# EAGLE board Titan_Teknic_v1p00a (EAGLE 9.6.2), part 1 of 2
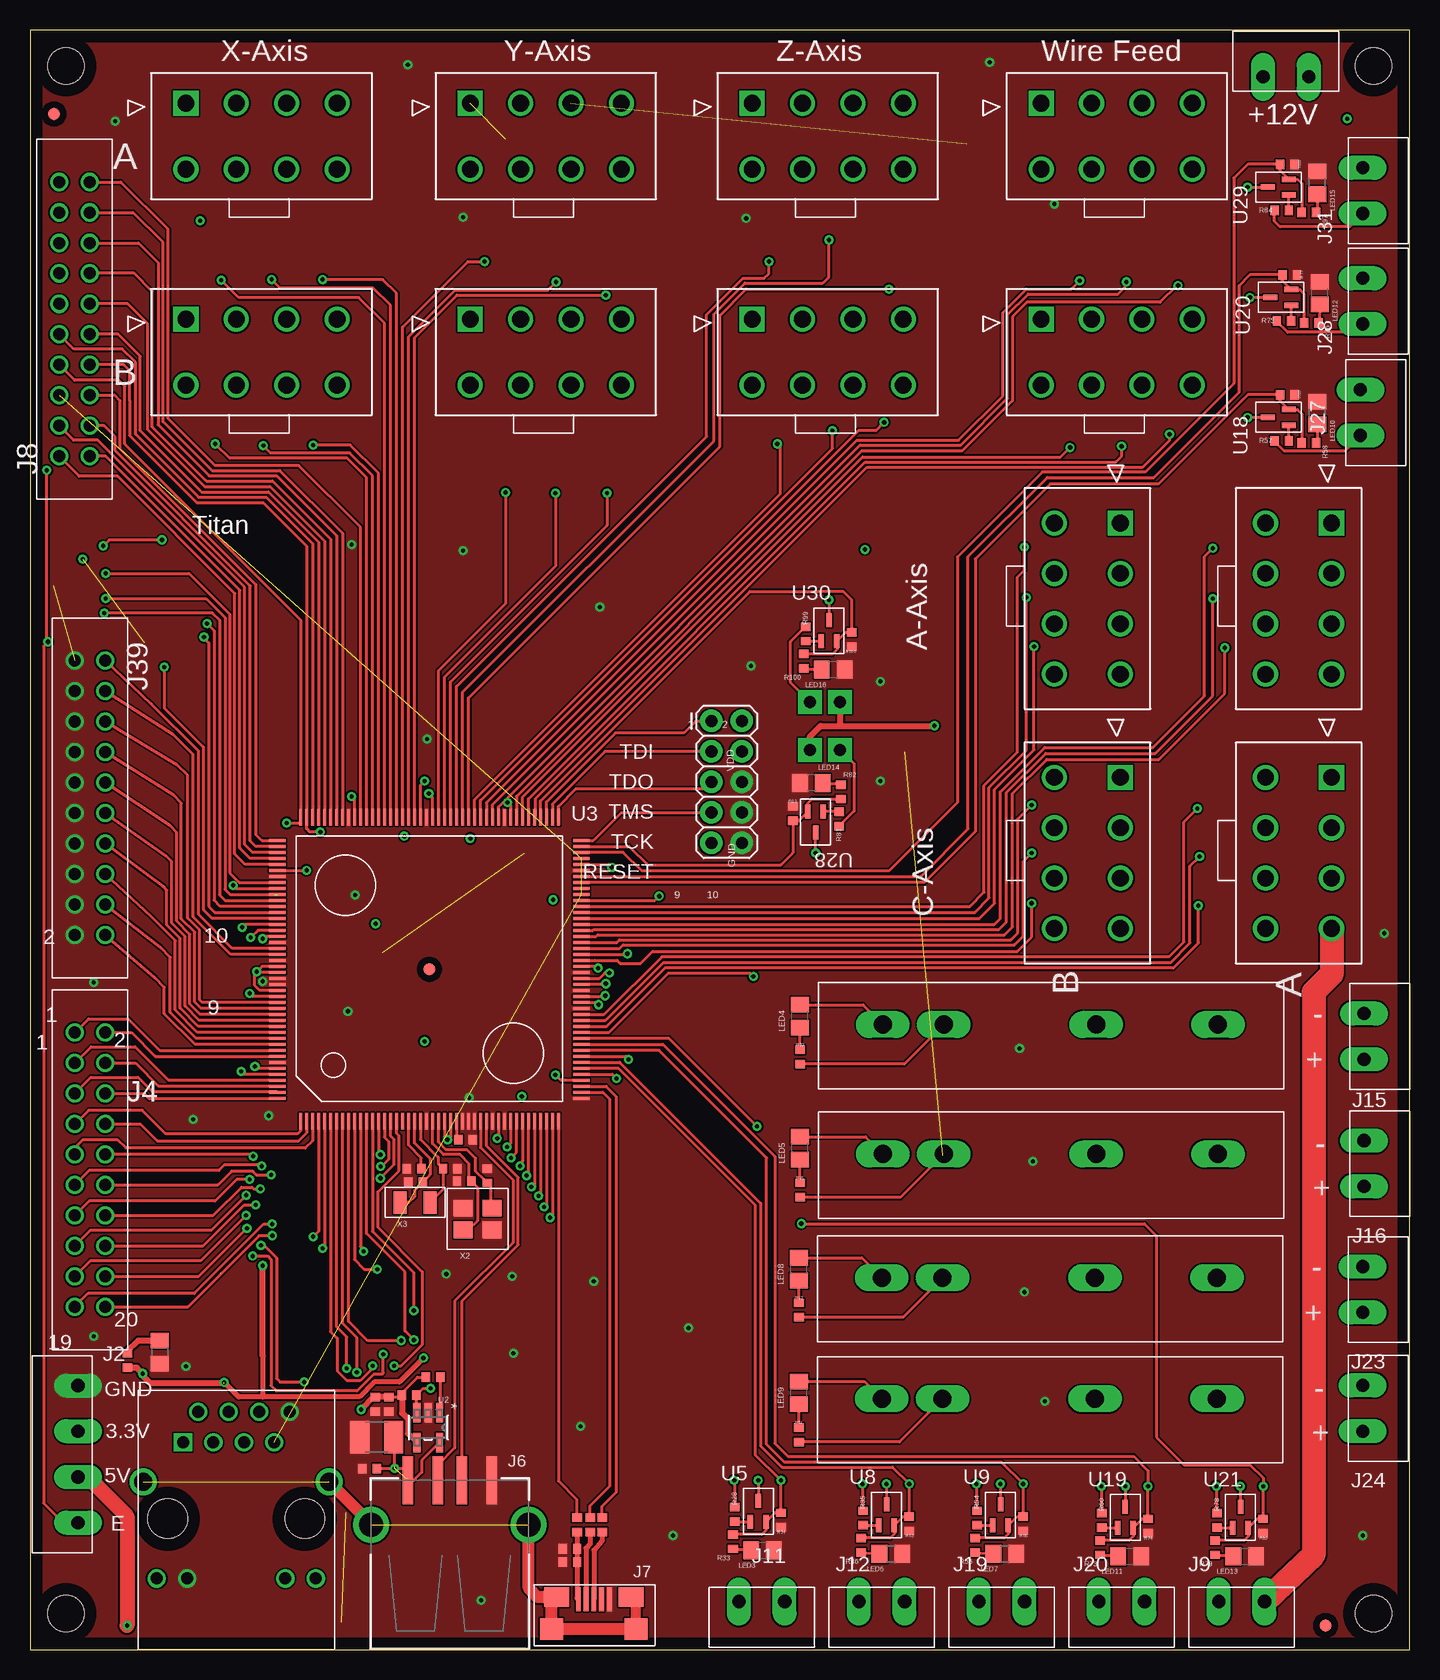
[diagram p7: board, top side]
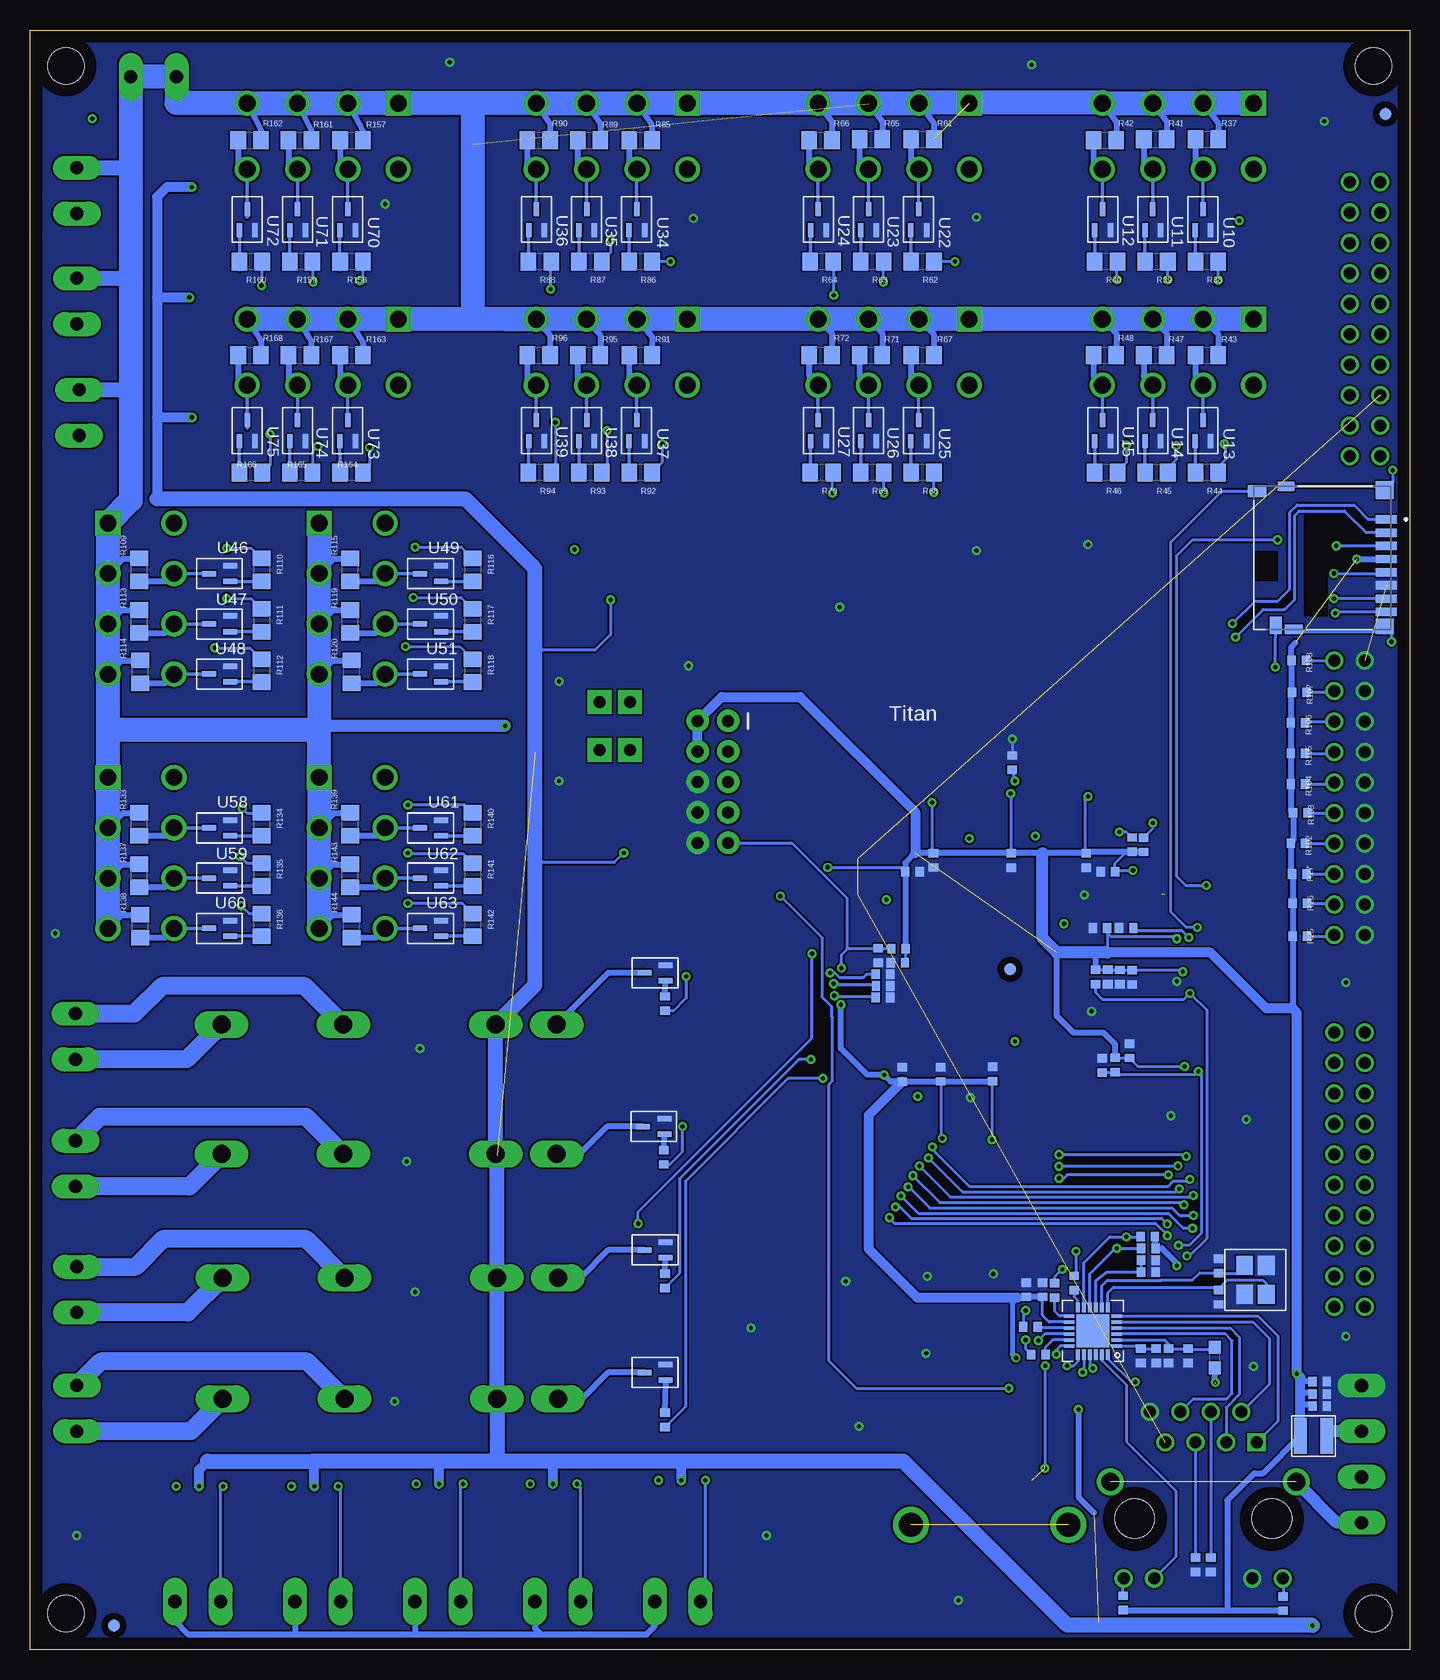
[diagram p8: board, bottom side, seen from below]

Size 115 x 135 mm. Coordinates in mm from the lower left corner, seen from the top.
Outline: 0,0 115,0 115,135 0,135 0,0
Copper layers (1*16): Top 0.035mm / dielectric 1.5mm / Bottom 0.035mm
Design rules "default": minimum track width 6mil, minimum drill 0.35mm, track to track 6mil, track to pad 6mil, pad to pad 6mil, via to via 6mil, smd to smd 6mil, copper to edge 40mil, drill to drill 6mil, minimum pad ring 10mil, minimum via ring 8mil, stop-mask expansion 4mil, vias tented up to drill 0mil, thermal gap 10mil
Holes 3 mm at 3,132 112,132 112,3 3,3

## Footprints (pad centres in the part's own frame; a part is rotated, then mirrored left to right if it is on the bottom)
FIDUCIAL_1MM = smd 1 x 1: 1 0,0
0402 = smd 0.8 x 0.7: P$1 0,0.6; P$2 0,-0.6
C1210 = smd 1.6 x 2.7: 1 -1.4,0; 2 1.4,0
0603 = smd 1.1 x 1: 1 -0.85,0; 2 0.85,0
SD_CARD = smd 0.7 x 1.75: 1 3.2,-5.285; 2 2.1,-5.285; 3 1,-5.285; 4 -0.1,-5.285; 5 -1.2,-5.285; 6 -2.3,-5.285; 7 -3.4,-5.285; 8 -4.5,-5.285 | smd 1 x 1.55: 9 5.575,5.515 | smd 1.45 x 1: 10 -5.625,3.94 | smd 1.5 x 1.5: S1 5.65,-5.16 | smd 1.3 x 1.5: S2 -5.7,-5.16 | smd 0.8 x 1.4: S3 5.975,3.09 | smd 0.8 x 1.5: S4 -5.95,2.44
1X4_3.81MM_PITCH = drill 1.1 pad 2 long: P$1 0,0; P$2 3.81,0; P$3 7.62,0; P$4 11.43,0
2X5 = drill 1 pad 1.88: 1 0,0; 2 0,2.54; 3 2.54,0; 4 2.54,2.54; 5 5.08,0; 6 5.08,2.54; 7 7.62,0; 8 7.62,2.54; 9 10.16,0; 10 10.16,2.54
2_X_10_.1_INCH = drill 1: P$1 -11.43,-1.27; P$2 -11.43,1.27; P$3 -8.89,-1.27; P$4 -8.89,1.27; P$5 -6.35,-1.27; P$6 -6.35,1.27; P$7 -3.81,-1.27; P$8 -3.81,1.27; P$9 -1.27,-1.27; P$10 -1.27,1.27; P$11 1.27,-1.27; P$12 1.27,1.27; P$13 3.81,-1.27; P$14 3.81,1.27; P$15 6.35,-1.27; P$16 6.35,1.27; P$17 8.89,-1.27; P$18 8.89,1.27; P$19 11.43,-1.27; P$20 11.43,1.27
USB_A_SMT = smd 4 x 0.9: D+ 6.7,-1; D- 6.7,1; GND 6.7,-3.5; VBUS 6.7,3.5 | drill 2: SHLD1 3,-6.566; SHLD2 3,6.566
USB_MICRO-B = smd 0.4 x 2: P$1 -1.3,2.475; P$2 -0.65,2.475; P$3 0,2.475; P$4 0.65,2.475; P$5 1.3,2.475 | smd 2.1 x 1.6: P$6 -3.1,2.675; P$7 3.1,2.675 | smd 1.9 x 1.8: P$8 -3.525,0; P$9 3.525,0
2_3.81MM_PITCH = drill 1.1 pad 2 long: P$1 0,0; P$2 3.81,0
CON_39281083 = drill 1.397 pad 1.905 square: 1 12.6,-5.5 | drill 1.397 pad 1.905: 2 8.4,-5.5; 3 4.2,-5.5; 4 0,-5.5; 5 12.6,0; 6 8.4,0; 7 4.2,0; 8 0,0
1008 = smd 3 x 1.1: 1 0,1.1; 2 0,-1.1
0805 = smd 1.3 x 1.5: 1 -0.95,0; 2 0.95,0
1_X_1_1MM_PIN = drill 1 pad 2 square: P$1 0,0
RJ45_TH_ELEC = drill 1 square: 1 -4.45,-2.54 | drill 1: 2 -3.18,0; 3 -1.91,-2.54; 4 -0.635,0; 5 0.635,-2.54; 6 1.91,0; 7 3.17,-2.54; 8 4.445,0; 9 -6.63,-13.88; 10 -4.09,-13.88; 11 4.09,-13.88; 12 6.63,-13.88 | drill 1.5: 13 -7.75,-5.84; 14 7.75,-5.84 | hole 3.299: 5.715,-8.89; -5.715,-8.89
QFN-24-M = smd 0.864 x 0.305: 1 -1.968,1.25; 2 -1.968,0.75; 3 -1.968,0.25; 4 -1.968,-0.25; 5 -1.968,-0.75; 6 -1.968,-1.25; 13 1.968,-1.25; 14 1.968,-0.75; 15 1.968,-0.25; 16 1.968,0.25; 17 1.968,0.75; 18 1.968,1.25 | smd 0.305 x 0.864: 7 -1.25,-1.968; 8 -0.75,-1.968; 9 -0.25,-1.968; 10 0.25,-1.968; 11 0.75,-1.968; 12 1.25,-1.968; 19 1.25,1.968; 20 0.75,1.968; 21 0.25,1.968; 22 -0.25,1.968; 23 -0.75,1.968; 24 -1.25,1.968 | smd 2.743 x 2.743: 25 0,0
SOT-23-5 = smd 1.626 x 0.61: 1 -1.245,0.95; 2 -1.245,0; 3 -1.245,-0.95; 4 1.245,-0.95; 5 1.245,0.95
LQFP176_24X24 = smd 1.372 x 0.254: 1 -12.675,10.75; 2 -12.675,10.25; 3 -12.675,9.75; 4 -12.675,9.25; 5 -12.675,8.75; 6 -12.675,8.25; 7 -12.675,7.75; 8 -12.675,7.25; 9 -12.675,6.75; 10 -12.675,6.25; 11 -12.675,5.75; 12 -12.675,5.25; 13 -12.675,4.75; 14 -12.675,4.25; 15 -12.675,3.75; 16 -12.675,3.25; 17 -12.675,2.75; 18 -12.675,2.25; 19 -12.675,1.75; 20 -12.675,1.25; 21 -12.675,0.75; 22 -12.675,0.25; 23 -12.675,-0.25; 24 -12.675,-0.75; 25 -12.675,-1.25; 26 -12.675,-1.75; 27 -12.675,-2.25; 28 -12.675,-2.75; 29 -12.675,-3.25; 30 -12.675,-3.75; 31 -12.675,-4.25; 32 -12.675,-4.75; 33 -12.675,-5.25; 34 -12.675,-5.75; 35 -12.675,-6.25; 36 -12.675,-6.75; 37 -12.675,-7.25; 38 -12.675,-7.75; 39 -12.675,-8.25; 40 -12.675,-8.75; 41 -12.675,-9.25; 42 -12.675,-9.75; 43 -12.675,-10.25; 44 -12.675,-10.75; 89 12.675,-10.75; 90 12.675,-10.25; 91 12.675,-9.75; 92 12.675,-9.25; 93 12.675,-8.75; 94 12.675,-8.25; 95 12.675,-7.75; 96 12.675,-7.25; 97 12.675,-6.75; 98 12.675,-6.25; 99 12.675,-5.75; 100 12.675,-5.25; 101 12.675,-4.75; 102 12.675,-4.25; 103 12.675,-3.75; 104 12.675,-3.25; 105 12.675,-2.75; 106 12.675,-2.25; 107 12.675,-1.75; 108 12.675,-1.25; 109 12.675,-0.75; 110 12.675,-0.25; 111 12.675,0.25; 112 12.675,0.75; 113 12.675,1.25; 114 12.675,1.75; 115 12.675,2.25; 116 12.675,2.75; 117 12.675,3.25; 118 12.675,3.75; 119 12.675,4.25; 120 12.675,4.75; 121 12.675,5.25; 122 12.675,5.75; 123 12.675,6.25; 124 12.675,6.75; 125 12.675,7.25; 126 12.675,7.75; 127 12.675,8.25; 128 12.675,8.75; 129 12.675,9.25; 130 12.675,9.75; 131 12.675,10.25; 132 12.675,10.75 | smd 0.254 x 1.372: 45 -10.75,-12.675; 46 -10.25,-12.675; 47 -9.75,-12.675; 48 -9.25,-12.675; 49 -8.75,-12.675; 50 -8.25,-12.675; 51 -7.75,-12.675; 52 -7.25,-12.675; 53 -6.75,-12.675; 54 -6.25,-12.675; 55 -5.75,-12.675; 56 -5.25,-12.675; 57 -4.75,-12.675; 58 -4.25,-12.675; 59 -3.75,-12.675; 60 -3.25,-12.675; 61 -2.75,-12.675; 62 -2.25,-12.675; 63 -1.75,-12.675; 64 -1.25,-12.675; 65 -0.75,-12.675; 66 -0.25,-12.675; 67 0.25,-12.675; 68 0.75,-12.675; 69 1.25,-12.675; 70 1.75,-12.675; 71 2.25,-12.675; 72 2.75,-12.675; 73 3.25,-12.675; 74 3.75,-12.675; 75 4.25,-12.675; 76 4.75,-12.675; 77 5.25,-12.675; 78 5.75,-12.675; 79 6.25,-12.675; 80 6.75,-12.675; 81 7.25,-12.675; 82 7.75,-12.675; 83 8.25,-12.675; 84 8.75,-12.675; 85 9.25,-12.675; 86 9.75,-12.675; 87 10.25,-12.675; 88 10.75,-12.675; 133 10.75,12.675; 134 10.25,12.675; 135 9.75,12.675; 136 9.25,12.675; 137 8.75,12.675; 138 8.25,12.675; 139 7.75,12.675; 140 7.25,12.675; 141 6.75,12.675; 142 6.25,12.675; 143 5.75,12.675; 144 5.25,12.675; 145 4.75,12.675; 146 4.25,12.675; 147 3.75,12.675; 148 3.25,12.675; 149 2.75,12.675; 150 2.25,12.675; 151 1.75,12.675; 152 1.25,12.675; 153 0.75,12.675; 154 0.25,12.675; 155 -0.25,12.675; 156 -0.75,12.675; 157 -1.25,12.675; 158 -1.75,12.675; 159 -2.25,12.675; 160 -2.75,12.675; 161 -3.25,12.675; 162 -3.75,12.675; 163 -4.25,12.675; 164 -4.75,12.675; 165 -5.25,12.675; 166 -5.75,12.675; 167 -6.25,12.675; 168 -6.75,12.675; 169 -7.25,12.675; 170 -7.75,12.675; 171 -8.25,12.675; 172 -8.75,12.675; 173 -9.25,12.675; 174 -9.75,12.675; 175 -10.25,12.675; 176 -10.75,12.675
SOT323 = smd 0.457 x 1.168: 1 -0.65,-0.876; 2 0.65,-0.876; 3 0,0.876
RELAY_KYOTO_KF0604D = drill 1.5 long: P$1 0,0; P$2 -5.08,0; P$3 -17.78,0; P$4 -27.94,0
SMD_3225 = smd 1.6 x 1.4: 1 -1.2,-0.9; 2 1.2,-0.9; 3 1.2,0.9; 4 -1.2,0.9
SMD_X_2_PADS = smd 1.9 x 1.1: P$1 0,1.25; P$2 0,-1.25

## Placement (x,y rotation side)
AFID1  FIDUCIAL_1MM  [FIDUCIAL_1MM]  108,2 0 top
AFID2  FIDUCIAL_1MM  [FIDUCIAL_1MM]  2,128 0 top
AFID3  FIDUCIAL_1MM  [FIDUCIAL_1MM]  33.3,56.7 0 top
AFID4  FIDUCIAL_1MM  [FIDUCIAL_1MM]  108,2 0 bottom
AFID5  FIDUCIAL_1MM  [FIDUCIAL_1MM]  2,128 0 bottom
AFID6  FIDUCIAL_1MM  [FIDUCIAL_1MM]  33.3,56.7 0 bottom
C1  24pF  [0402]  15.91,31.98 180 bottom
C2  24pF  [0402]  15.91,29.37 0 bottom
C3  100pF  [0402]  21.76,31.46 90 bottom
C4  0.1uF  [0402]  7.5,22.35 90 bottom
C5  10uF  [0402]  7.5,21.3 90 bottom
C6  10uF  [0402]  25.61,48.7 180 bottom
C7  0.1uF  [0402]  7.5,20.3 90 bottom
C8  22uF  [0402]  18.46,24.48 0 bottom
C9  0.1uF  [0402]  20.09,24.48 0 bottom
C10  0.1uF  [0402]  22.4,24.48 0 bottom
C11  2.2uF  [0402]  21.12,24.48 0 bottom
C12  0.1uF  [0402]  16.56,7.07 0 bottom
C13  0.1uF  [0402]  17.84,7.07 0 bottom
C14  22uF  [0402]  31.95,30 180 bottom
C15  0.1uF  [0402]  30.6,30 180 bottom
C16  10uF  [0402]  44.28,57.85 0 bottom
C17  18pF  [0402]  36.2,39.03 270 top
C18  18pF  [0402]  38.13,39.5 180 top
C19  0.1uF  [0402]  25.8,60.15 90 bottom
C20  0.1uF  [0402]  25.16,64.82 90 bottom
C21  1uF  [0402]  25.15,56.06 180 bottom
C22  0.1uF  [0402]  24.15,56.05 180 bottom
C23  10uF  [0402]  29.9,20.45 0 top
C24  0.1uF  [0402]  23.62,60.14 90 bottom
C25  0.1uF  [0402]  23.13,56.04 180 bottom
C26  0.1uF  [0402]  28.8,20.45 0 top
C27  0.1uF  [0402]  23.35,49.91 0 bottom
C28  1uF  [0402]  45,8.4 270 top
C29  0.1uF  [0402]  28.3,15.1 270 top
C30  0.1uF  [0402]  26.97,65.78 180 bottom
C31  100uF_Tant  [C1210]  28.9,17.7 180 top
C32  12pF  [0402]  32.14,38.97 270 top
C33  0.1uF  [0402]  32.02,40.07 270 top
C34  0.1uF  [0402]  33.11,73.92 0 bottom
C35  0.1uF  [0402]  33.2,65.78 180 bottom
C36  0.1uF  [0402]  34.76,47.99 180 bottom
C37  12pF  [0402]  35.03,40.07 90 top
C38  0.1uF  [0402]  39.69,65.79 180 bottom
C39  0.1uF  [0402]  39.09,47.95 180 bottom
C40  0.1uF  [0402]  42.66,57.24 270 bottom
C41  1uF  [0402]  41.44,64.84 90 bottom
C42  0.1uF  [0402]  43.9,54.35 90 bottom
C43  0.1uF  [0402]  42.29,47.94 0 bottom
FB1  FB2_603  [0603]  16.22,24.33 90 bottom
J1  SD_CARD  [SD_CARD]  7.21,91 90 bottom
J2  4-pos  [1X4_3.81MM_PITCH]  4,22 270 top
J3  10-pos  [2X5]  56.8,77.4 270 top
J4  20-pos  [2_X_10_.1_INCH]  5,40 270 top
J6  USB-A  [USB_A_SMT]  35,7.4 90 top
J7  USB-B-Micro  [USB_MICRO-B]  47,1.7 0 top
J8  [2_X_10_.1_INCH]  3.7,110.9 90 top
J9  2-pos  [2_3.81MM_PITCH]  99.1,4 0 top
J10  2-pos  [2_3.81MM_PITCH]  106.6,131.1 180 top
J11  2-pos  [2_3.81MM_PITCH]  59.1,4 0 top
J12  2-pos  [2_3.81MM_PITCH]  69.1,4 0 top
J13  [CON_39281083]  25.6,123.4 180 top
J14  [CON_39281083]  25.6,105.4 180 top
J15  2-pos  [2_3.81MM_PITCH]  111.2,49.2 90 top
J16  2-pos  [2_3.81MM_PITCH]  111.2,38.6 90 top
J17  [CON_39281083]  49.3,123.4 180 top
J18  [CON_39281083]  49.3,105.4 180 top
J19  2-pos  [2_3.81MM_PITCH]  79.1,4 0 top
J20  2-pos  [2_3.81MM_PITCH]  89.1,4 0 top
J21  [CON_39281083]  72.8,123.4 180 top
J22  [CON_39281083]  72.8,105.4 180 top
J23  2-pos  [2_3.81MM_PITCH]  111.1,28.1 90 top
J24  2-pos  [2_3.81MM_PITCH]  111.1,18.2 90 top
J25  [CON_39281083]  103,81.3 90 top
J26  [CON_39281083]  85.4,81.3 90 top
J27  2-pos  [2_3.81MM_PITCH]  110.9,101.2 90 top
J28  2-pos  [2_3.81MM_PITCH]  111.1,110.5 90 top
J29  [CON_39281083]  103,60.1 90 top
J30  [CON_39281083]  85.4,60.1 90 top
J31  2-pos  [2_3.81MM_PITCH]  111.1,119.7 90 top
J33  [CON_39281083]  96.9,123.4 180 top
J34  [CON_39281083]  96.9,105.4 180 top
J39  [2_X_10_.1_INCH]  5,71 270 top
L1  2.2uH  [1008]  8,17.8 270 bottom
LED1  Green  [0805]  10.8,24.8 270 top
LED3  Green  [0805]  61.06,8.28 0 top
LED4  Green  [0805]  64.2,52.8 90 top
LED5  Green  [0805]  64.2,41.8 90 top
LED6  Green  [0805]  71.76,7.98 0 top
LED7  Green  [0805]  81.26,7.98 0 top
LED8  Green  [0805]  64.1,31.7 90 top
LED9  Green  [0805]  64.1,21.4 90 top
LED10  Green  [0805]  107.32,103.06 90 top
LED11  Green  [0805]  91.66,7.78 0 top
LED12  Green  [0805]  107.52,113.06 90 top
LED13  Green  [0805]  101.26,7.78 0 top
LED14  Green  [0805]  65.14,72.22 180 top
LED15  Green  [0805]  107.32,122.26 90 top
LED16  Green  [0805]  66.96,81.68 0 top
P1  [1_X_1_1MM_PIN]  67.54,75 0 top
P2  [1_X_1_1MM_PIN]  65,75 0 top
P3  [1_X_1_1MM_PIN]  65,79 0 top
P4  [1_X_1_1MM_PIN]  67.54,79 0 top
R1  6K49  [0402]  21.78,32.46 270 bottom
R2  10K0  [0402]  26.16,56.07 180 bottom
R3  10K0  [0402]  24.54,48.72 180 bottom
R4  1K5  [0402]  21.83,34.41 90 bottom
R5  470R0  [0402]  8.12,24.09 0 top
R6  1K5  [0402]  21.78,33.44 90 bottom
R7  470R0  [0402]  23.89,3.88 0 bottom
R8  470R0  [0402]  10.54,3.83 0 bottom
R9  33R0  [0402]  27.95,30.55 0 bottom
R10  33R0  [0402]  29.6,29.95 0 bottom
R11  33R0  [0402]  30.95,24.6 90 bottom
R12  33R0  [0402]  31.6,26.9 90 bottom
R13  10K0  [0402]  42.58,58.42 90 bottom
R14  1K0  [0402]  22.15,67.08 180 bottom
R15  1K0  [0402]  23.13,67.08 180 bottom
R16  15K0  [0402]  45.6,10.4 0 top
R17  27R0  [0402]  46.7,10.4 0 top
R18  27R0  [0402]  47.7,10.4 0 top
R19  10K0  [0402]  31.6,21.2 270 top
R20  10K0  [0402]  33.6,22.7 270 top
R21  30K0  [0402]  45,7.3 90 top
R22  2K2  [0402]  36.31,42.5 270 top
R23  10K0  [0402]  43.88,55.32 270 bottom
R24  10K0  [0402]  43.89,56.28 270 bottom
R25  100K  [0402]  9.15,59.45 270 bottom
R26  100K  [0402]  9.15,62.2 270 bottom
R27  100K  [0402]  9.2,64.65 270 bottom
R28  2.2K  [0402]  58.75,11.26 0 top
R29  500R0  [0402]  62.06,53.84 180 bottom
R30  500R0  [0402]  62.16,41.04 180 bottom
R31  470R0  [0402]  64.2,38.3 0 top
R32  470R0  [0402]  64.2,49.4 0 top
R33  470R0  [0402]  58.6,9 180 top
R34  10K0  [0402]  62.6,10.8 180 top
R35  2.2K  [0402]  69.45,10.96 0 top
R36  470R0  [0402]  69.3,8.7 180 top
R37  1k  [0805]  16.9,125.9 0 bottom
R38  33  [0805]  16.9,115.7 180 bottom
R39  33  [0805]  21.1,115.7 180 bottom
R40  33  [0805]  25.3,115.7 180 bottom
R41  1k  [0805]  21.2,125.9 0 bottom
R42  1k  [0805]  25.4,125.8 0 bottom
R43  1k  [0805]  16.9,107.9 0 bottom
R44  33  [0805]  16.9,98.1 180 bottom
R45  33  [0805]  21.1,98.1 180 bottom
R46  33  [0805]  25.3,98.1 180 bottom
R47  1k  [0805]  21.2,107.9 0 bottom
R48  1k  [0805]  25.4,107.9 0 bottom
R49  500R0  [0402]  62.06,30.74 180 bottom
R50  500R0  [0402]  62.06,19.14 180 bottom
R51  470R0  [0402]  64.1,17.9 0 top
R52  470R0  [0402]  64.1,28.3 0 top
R53  10K0  [0402]  73.3,10.5 180 top
R54  2.2K  [0402]  78.95,10.96 0 top
R55  470R0  [0402]  78.8,8.7 180 top
R56  10K0  [0402]  82.8,10.5 180 top
R57  2.2K  [0402]  104.34,100.75 90 top
R58  470R0  [0402]  106.6,100.6 270 top
R59  10K0  [0402]  104.8,104.6 270 top
R60  2.2K  [0402]  89.35,10.76 0 top
R61  1k  [0805]  40.6,125.9 0 bottom
R62  33  [0805]  40.6,115.7 180 bottom
R63  33  [0805]  44.8,115.7 180 bottom
R64  33  [0805]  49,115.7 180 bottom
R65  1k  [0805]  44.9,125.9 0 bottom
R66  1k  [0805]  49.1,125.8 0 bottom
R67  1k  [0805]  40.6,107.9 0 bottom
R68  33  [0805]  40.6,98.1 180 bottom
R69  33  [0805]  44.8,98.1 180 bottom
R70  33  [0805]  49,98.1 180 bottom
R71  1k  [0805]  44.9,107.9 0 bottom
R72  1k  [0805]  49.1,107.9 0 bottom
R73  470R0  [0402]  89.2,8.5 180 top
R74  10K0  [0402]  93.2,10.3 180 top
R75  2.2K  [0402]  104.54,110.75 90 top
R76  470R0  [0402]  106.8,110.6 270 top
R77  10K0  [0402]  105,114.6 270 top
R78  2.2K  [0402]  98.95,10.76 0 top
R79  470R0  [0402]  98.8,8.5 180 top
R80  10K0  [0402]  102.8,10.3 180 top
R81  2.2K  [0402]  67.45,69.24 180 top
R82  470R0  [0402]  67.6,71.5 0 top
R83  10K0  [0402]  63.6,69.7 0 top
R84  2.2K  [0402]  104.34,119.95 90 top
R85  1k  [0805]  64.1,125.8 0 bottom
R86  33  [0805]  64.1,115.7 180 bottom
R87  33  [0805]  68.3,115.7 180 bottom
R88  33  [0805]  72.5,115.7 180 bottom
R89  1k  [0805]  68.4,125.8 0 bottom
R90  1k  [0805]  72.6,125.8 0 bottom
R91  1k  [0805]  64.1,107.9 0 bottom
R92  33  [0805]  64.1,98.1 180 bottom
R93  33  [0805]  68.3,98.1 180 bottom
R94  33  [0805]  72.5,98.1 180 bottom
R95  1k  [0805]  68.4,107.9 0 bottom
R96  1k  [0805]  72.6,107.9 0 bottom
R97  470R0  [0402]  106.6,119.8 270 top
R98  10K0  [0402]  104.8,123.8 270 top
R99  2.2K  [0402]  64.65,84.66 0 top
R100  470R0  [0402]  64.5,82.4 180 top
R101  10K0  [0402]  68.5,84.2 180 top
R102  100K  [0402]  9.3,67.2 270 bottom
R103  100K  [0402]  9.1,69.75 270 bottom
R104  100K  [0402]  9.3,72.15 270 bottom
R105  100K  [0402]  9.3,74.7 270 bottom
R106  100K  [0402]  9.3,77.25 270 bottom
R107  100K  [0402]  9.2,79.8 270 bottom
R108  100K  [0402]  9.25,82.45 270 bottom
R109  1k  [0805]  105.9,90 90 bottom
R110  33  [0805]  95.7,90 270 bottom
R111  33  [0805]  95.7,85.8 270 bottom
R112  33  [0805]  95.7,81.6 270 bottom
R113  1k  [0805]  105.9,85.7 90 bottom
R114  1k  [0805]  105.8,81.5 90 bottom
R115  1k  [0805]  88.3,90 90 bottom
R116  33  [0805]  78.1,90 270 bottom
R117  33  [0805]  78.1,85.8 270 bottom
R118  33  [0805]  78.1,81.6 270 bottom
R119  1k  [0805]  88.3,85.7 90 bottom
R120  1k  [0805]  88.2,81.5 90 bottom
R133  1k  [0805]  105.9,68.8 90 bottom
R134  33  [0805]  95.7,68.8 270 bottom
R135  33  [0805]  95.7,64.6 270 bottom
R136  33  [0805]  95.7,60.4 270 bottom
R137  1k  [0805]  105.9,64.5 90 bottom
R138  1k  [0805]  105.8,60.3 90 bottom
R139  1k  [0805]  88.3,68.8 90 bottom
R140  33  [0805]  78.1,68.8 270 bottom
R141  33  [0805]  78.1,64.6 270 bottom
R142  33  [0805]  78.1,60.4 270 bottom
R143  1k  [0805]  88.3,64.5 90 bottom
R144  1k  [0805]  88.2,60.3 90 bottom
R157  1k  [0805]  88.2,125.8 0 bottom
R158  33  [0805]  88.2,115.7 180 bottom
R159  33  [0805]  92.4,115.7 180 bottom
R160  33  [0805]  96.6,115.7 180 bottom
R161  1k  [0805]  92.5,125.8 0 bottom
R162  1k  [0805]  96.7,125.8 0 bottom
R163  1k  [0805]  88.2,107.9 0 bottom
R164  33  [0805]  88.2,98.1 180 bottom
R165  33  [0805]  92.4,98.1 180 bottom
R166  33  [0805]  96.6,98.1 180 bottom
R167  1k  [0805]  92.5,107.9 0 bottom
R168  1k  [0805]  96.7,107.9 0 bottom
RJ1  RJ45  [RJ45_TH_ELEC]  17.2,19.8 0 top
U1  KSZ8081_QFN_24  [QFN-24-M]  26.4,26.55 180 bottom
U2  AP2151DWG-7  [SOT-23-5]  33.2,18.5 270 top
U3  S7G2LQFP176  [LQFP176_24X24]  33.3,56.7 90 top
U5  NPN  [SOT323]  60.71,11.52 0 top
U6  NPN  [SOT323]  62.9,56.4 90 bottom
U7  NPN  [SOT323]  63,43.6 90 bottom
U8  NPN  [SOT323]  71.41,11.22 0 top
U9  NPN  [SOT323]  80.91,11.22 0 top
U10  NPN  [SOT323]  17.22,119.2 0 bottom
U11  NPN  [SOT323]  21.4,119.2 0 bottom
U12  NPN  [SOT323]  25.58,119.2 0 bottom
U13  NPN  [SOT323]  17.22,101.6 0 bottom
U14  NPN  [SOT323]  21.4,101.6 0 bottom
U15  NPN  [SOT323]  25.58,101.6 0 bottom
U16  NPN  [SOT323]  62.9,33.3 90 bottom
U17  NPN  [SOT323]  62.9,23.1 90 bottom
U18  NPN  [SOT323]  104.08,102.71 90 top
U19  NPN  [SOT323]  91.31,11.02 0 top
U20  NPN  [SOT323]  104.28,112.71 90 top
U21  NPN  [SOT323]  100.91,11.02 0 top
U22  NPN  [SOT323]  40.92,119.2 0 bottom
U23  NPN  [SOT323]  45.1,119.2 0 bottom
U24  NPN  [SOT323]  49.28,119.2 0 bottom
U25  NPN  [SOT323]  40.92,101.6 0 bottom
U26  NPN  [SOT323]  45.1,101.6 0 bottom
U27  NPN  [SOT323]  49.28,101.6 0 bottom
U28  NPN  [SOT323]  65.49,68.98 180 top
U29  NPN  [SOT323]  104.08,121.91 90 top
U30  NPN  [SOT323]  66.61,84.92 0 top
U34  NPN  [SOT323]  64.42,119.2 0 bottom
U35  NPN  [SOT323]  68.6,119.2 0 bottom
U36  NPN  [SOT323]  72.78,119.2 0 bottom
U37  NPN  [SOT323]  64.42,101.6 0 bottom
U38  NPN  [SOT323]  68.6,101.6 0 bottom
U39  NPN  [SOT323]  72.78,101.6 0 bottom
U46  NPN  [SOT323]  99.2,89.68 90 bottom
U47  NPN  [SOT323]  99.2,85.5 90 bottom
U48  NPN  [SOT323]  99.2,81.32 90 bottom
U49  NPN  [SOT323]  81.6,89.68 90 bottom
U50  NPN  [SOT323]  81.6,85.5 90 bottom
U51  NPN  [SOT323]  81.6,81.32 90 bottom
U58  NPN  [SOT323]  99.2,68.48 90 bottom
U59  NPN  [SOT323]  99.2,64.3 90 bottom
U60  NPN  [SOT323]  99.2,60.12 90 bottom
U61  NPN  [SOT323]  81.6,68.48 90 bottom
U62  NPN  [SOT323]  81.6,64.3 90 bottom
U63  NPN  [SOT323]  81.6,60.12 90 bottom
U70  NPN  [SOT323]  88.52,119.2 0 bottom
U71  NPN  [SOT323]  92.7,119.2 0 bottom
U72  NPN  [SOT323]  96.88,119.2 0 bottom
U73  NPN  [SOT323]  88.52,101.6 0 bottom
U74  NPN  [SOT323]  92.7,101.6 0 bottom
U75  NPN  [SOT323]  96.88,101.6 0 bottom
U$1  RELAY_KYOTO_KF0604D  [RELAY_KYOTO_KF0604D]  71.1,52.1 180 top
U$2  RELAY_KYOTO_KF0604D  [RELAY_KYOTO_KF0604D]  71.1,41.3 180 top
U$7  RELAY_KYOTO_KF0604D  [RELAY_KYOTO_KF0604D]  71,31 180 top
U$8  RELAY_KYOTO_KF0604D  [RELAY_KYOTO_KF0604D]  71,20.9 180 top
X1  25MHz  [SMD_3225]  12.85,30.81 270 bottom
X2  24MHz  [SMD_3225]  37.31,35.89 0 top
X3  32.768KHz  [SMD_X_2_PADS]  32.1,37.26 90 top